# Altium schematic sheet EE194_YESDIG_PCB.SchDoc
size A2
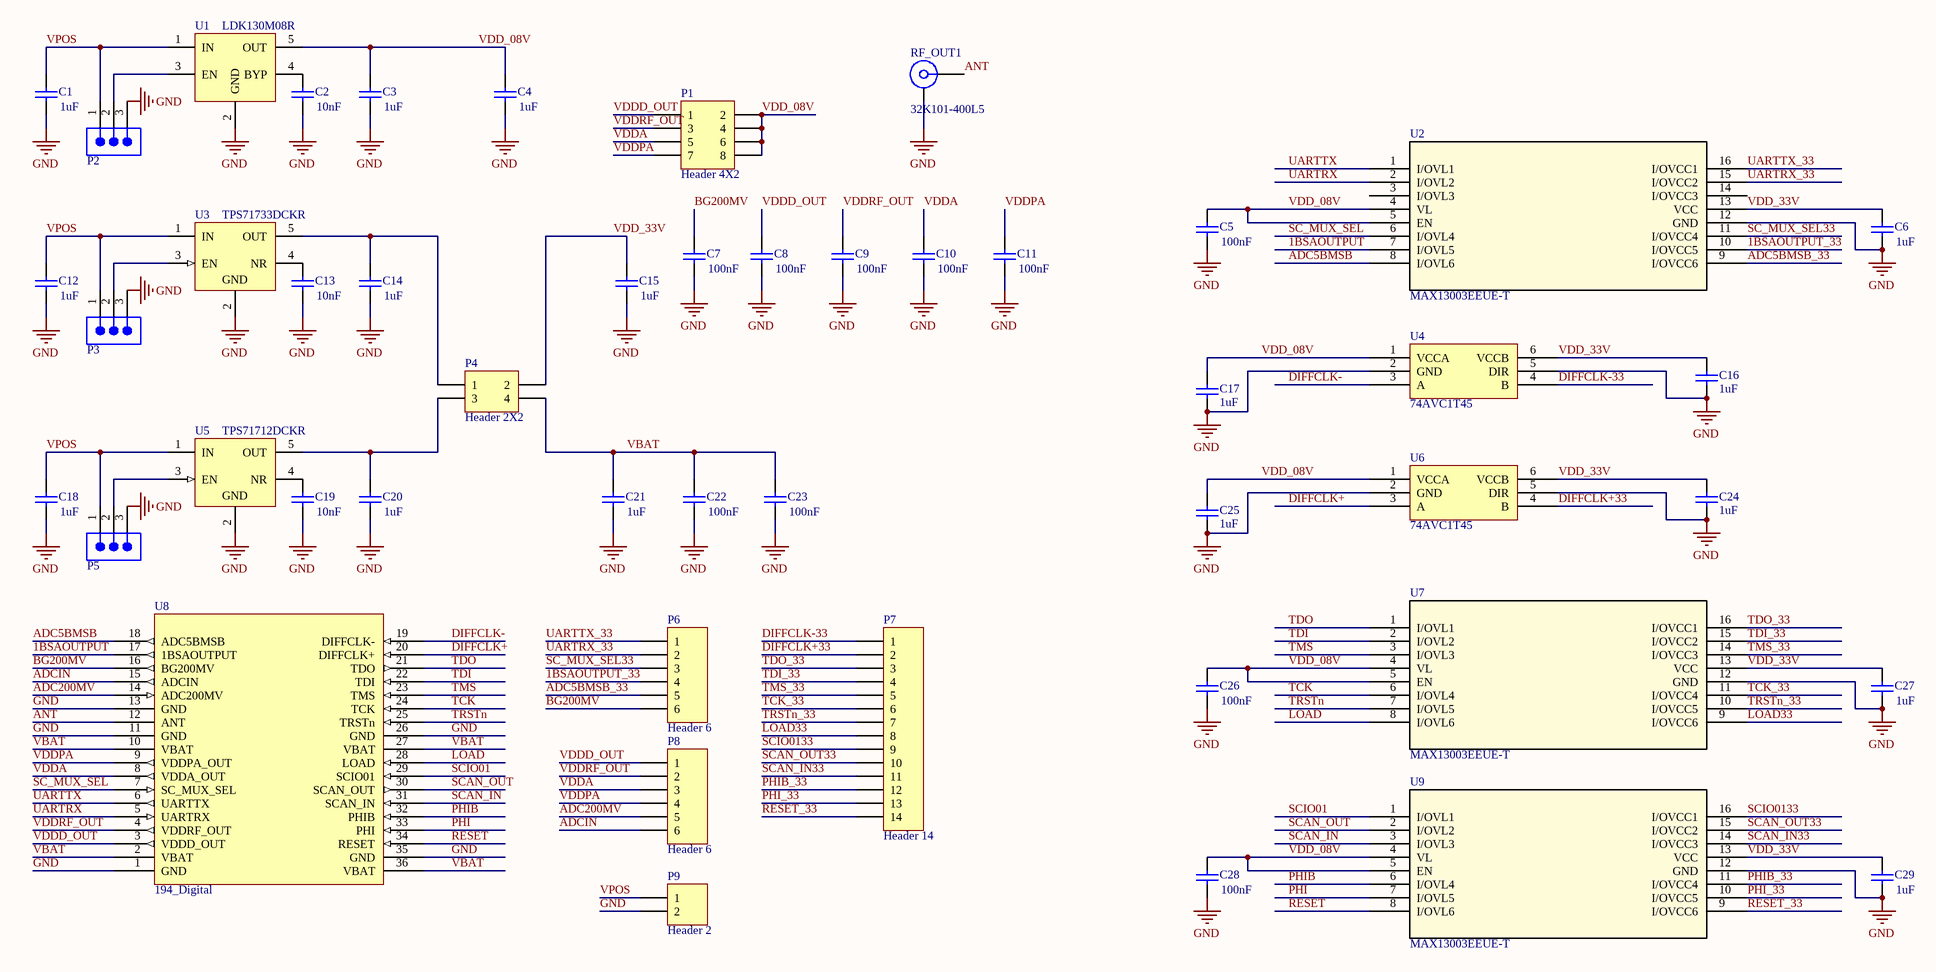
[diagram p0: EE194_YESDIG_PCB.SchDoc]

## Parts
C1  value 1uF  [1608[0603]]  (hidden comment: Cap Semi)
C2  value 10nF  [1608[0603]]  (hidden comment: Cap Semi)
C3  value 1uF  [1608[0603]]  (hidden comment: Cap Semi)
C4  value 1uF  [1608[0603]]  (hidden comment: Cap Semi)
C5  value 100nF  [0402]  (hidden comment: Cap Semi)
C6  value 1uF  [0402]  (hidden comment: Cap Semi)
C7  value 100nF  [0402]  (hidden comment: Cap Semi)
C8  value 100nF  [0402]  (hidden comment: Cap Semi)
C9  value 100nF  [0402]  (hidden comment: Cap Semi)
C10  value 100nF  [0402]  (hidden comment: Cap Semi)
C11  value 100nF  [0402]  (hidden comment: Cap Semi)
C12  value 1uF  [1608[0603]]  (hidden comment: Cap Semi)
C13  value 10nF  [1608[0603]]  (hidden comment: Cap Semi)
C14  value 1uF  [1608[0603]]  (hidden comment: Cap Semi)
C15  value 1uF  [1608[0603]]  (hidden comment: Cap Semi)
C16  value 1uF  [CAPC0402(1005)60_M]  (hidden comment: CAP 1uF 16V 0402(1005))
C17  value 1uF  [CAPC0402(1005)60_M]  (hidden comment: CAP 1uF 16V 0402(1005))
C18  value 1uF  [1608[0603]]  (hidden comment: Cap Semi)
C19  value 10nF  [1608[0603]]  (hidden comment: Cap Semi)
C20  value 1uF  [1608[0603]]  (hidden comment: Cap Semi)
C21  value 1uF  [1608[0603]]  (hidden comment: Cap Semi)
C22  value 100nF  [0402]  (hidden comment: Cap Semi)
C23  value 100nF  [0402]  (hidden comment: Cap Semi)
C24  value 1uF  [CAPC0402(1005)60_M]  (hidden comment: CAP 1uF 16V 0402(1005))
C25  value 1uF  [CAPC0402(1005)60_M]  (hidden comment: CAP 1uF 16V 0402(1005))
C26  value 100nF  [0402]  (hidden comment: Cap Semi)
C27  value 1uF  [0402]  (hidden comment: Cap Semi)
C28  value 100nF  [0402]  (hidden comment: Cap Semi)
C29  value 1uF  [0402]  (hidden comment: Cap Semi)
P1  Header 4X2  [HDR2X4]
P2  TSW-103-07-F-S  [SMTC-TSW-103-07-X-S]  (value not drawn)
P3  TSW-103-07-F-S  [SMTC-TSW-103-07-X-S]  (value not drawn)
P4  Header 2X2  [HDR2X2]
P5  TSW-103-07-F-S  [SMTC-TSW-103-07-X-S]  (value not drawn)
P6  Header 6  [HDR1X6]
P7  Header 14  [HDR1X14]
P8  Header 6  [HDR1X6]
P9  Header 2  [HDR1X2]
RF_OUT1  32K101-400L5  [ROS-32K101-400L5_V]
U1  LDK130M08R  [SOT95P290X145-5N]
U2  MAX13003EEUE-T  [21-0066J_16]
U3  TPS71733DCKR  [DCK0005A_L]
U4  74AVC1T45  [ONSC-SC-88-6-419B-02_L]
U5  TPS71712DCKR  [DCK0005A_L]
U6  74AVC1T45  [ONSC-SC-88-6-419B-02_L]
U7  MAX13003EEUE-T  [21-0066J_16]
U8  194_Digital  [EE194_Analog_Chip - 3 mil]
U9  MAX13003EEUE-T  [21-0066J_16]

## Nets
GND: C1.1 C2.1 C3.1 C4.1 C5.1 C6.1 C7.1 C8.1 C9.1 C10.1 C11.1 C12.1 C13.1 C14.1 C15.1 C16.2 C17.2 C18.1 C19.1 C20.1 C21.1 C22.1 C23.1 C24.2 C25.2 C26.1 C27.1 C28.1 C29.1 P2.3 P3.3 P5.3 P9.2 RF_OUT1.MH U1.2(GND) U2.12(GND) U3.2(GND) U4.2(GND) U4.5(DIR) U5.2(GND) U6.2(GND) U6.5(DIR) U7.12(GND) U8.1(GND) U8.11(GND) U8.13(GND) U8.26(GND) U8.35(GND) U9.12(GND)
1BSAOUTPUT: U2.7(I/OVL5) U8.17(1BSAOUTPUT)
1BSAOUTPUT_33: P6.4 U2.10(I/OVCC5)
ADC5BMSB: U2.8(I/OVL6) U8.18(ADC5BMSB)
ADC5BMSB_33: P6.5 U2.9(I/OVCC6)
ADC200MV: P8.5 U8.14(ADC200MV)
ADCIN: P8.6 U8.15(ADCIN)
ANT: RF_OUT1.1 U8.12(ANT)
BG200MV: C7.2 P6.6 U8.16(BG200MV)
DIFFCLK+: U6.3(A) U8.20(DIFFCLK+)
DIFFCLK+33: P7.2 U6.4(B)
DIFFCLK-: U4.3(A) U8.19(DIFFCLK-)
DIFFCLK-33: P7.1 U4.4(B)
LOAD: U7.8(I/OVL6) U8.28(LOAD)
LOAD33: P7.8 U7.9(I/OVCC6)
PHI: U8.33(PHI) U9.7(I/OVL5)
PHI_33: P7.13 U9.10(I/OVCC5)
PHIB: U8.32(PHIB) U9.6(I/OVL4)
PHIB_33: P7.12 U9.11(I/OVCC4)
RESET: U8.34(RESET) U9.8(I/OVL6)
RESET_33: P7.14 U9.9(I/OVCC6)
SC_MUX_SEL: U2.6(I/OVL4) U8.7(SC_MUX_SEL)
SC_MUX_SEL33: P6.3 U2.11(I/OVCC4)
SCAN_IN: U8.31(SCAN_IN) U9.3(I/OVL3)
SCAN_IN33: P7.11 U9.14(I/OVCC3)
SCAN_OUT: U8.30(SCAN_OUT) U9.2(I/OVL2)
SCAN_OUT33: P7.10 U9.15(I/OVCC2)
SCIO01: U8.29(SCIO01) U9.1(I/OVL1)
SCIO0133: P7.9 U9.16(I/OVCC1)
TCK: U7.6(I/OVL4) U8.24(TCK)
TCK_33: P7.6 U7.11(I/OVCC4)
TDI: U7.2(I/OVL2) U8.22(TDI)
TDI_33: P7.4 U7.15(I/OVCC2)
TDO: U7.1(I/OVL1) U8.21(TDO)
TDO_33: P7.3 U7.16(I/OVCC1)
TMS: U7.3(I/OVL3) U8.23(TMS)
TMS_33: P7.5 U7.14(I/OVCC3)
TRSTn: U7.7(I/OVL5) U8.25(TRSTn)
TRSTn_33: P7.7 U7.10(I/OVCC5)
UARTRX: U2.2(I/OVL2) U8.5(UARTRX)
UARTRX_33: P6.2 U2.15(I/OVCC2)
UARTTX: U2.1(I/OVL1) U8.6(UARTTX)
UARTTX_33: P6.1 U2.16(I/OVCC1)
VBAT: C21.2 C22.2 C23.2 P4.4 U8.2(VBAT) U8.10(VBAT) U8.27(VBAT) U8.36(VBAT)
VDD_08V: C3.2 C4.2 C5.2 C17.1 C25.1 C26.2 C28.2 P1.2 P1.4 P1.6 P1.8 U1.5(OUT) U2.4(VL) U2.5(EN) U4.1(VCCA) U6.1(VCCA) U7.4(VL) U7.5(EN) U9.4(VL) U9.5(EN)
VDD_33V: C6.2 C15.2 C16.1 C24.1 C27.2 C29.2 P4.2 U2.13(VCC) U4.6(VCCB) U6.6(VCCB) U7.13(VCC) U9.13(VCC)
VDDA: C10.2 P1.5 P8.3 U8.8(VDDA_OUT)
VDDD_OUT: C8.2 P1.1 P8.1 U8.3(VDDD_OUT)
VDDPA: C11.2 P1.7 P8.4 U8.9(VDDPA_OUT)
VDDRF_OUT: C9.2 P1.3 P8.2 U8.4(VDDRF_OUT)
VPOS: C1.2 C12.2 C18.2 P2.1 P3.1 P5.1 P9.1 U1.1(IN) U3.1(IN) U5.1(IN)
NetC2_2: C2.2 U1.4(BYP)
NetC13_2: C13.2 U3.4(NR)
NetC14_2: C14.2 P4.1 U3.5(OUT)
NetC19_2: C19.2 U5.4(NR)
NetC20_2: C20.2 P4.3 U5.5(OUT)
NetP2_2: P2.2 U1.3(EN)
NetP3_2: P3.2 U3.3(EN)
NetP5_2: P5.2 U5.3(EN)

Not connected (* = marked no-connect by the designer): U2 3(I/OVL3) 14(I/OVCC3)

## Library data of the parts
C1-C15 C18-C23 C26-C29 = Cap Semi: Capacitor (Semiconductor SIM Model); Published: 8-Jun-2000; LatestRevisionDate: 29-May-2009; LatestRevisionNote: IPC-7351 Footprint Added.; PackageReference: C1206; Publisher: Altium Limited; PackageDescription: Chip Capacitor
C16 C17 C24 C25 = CMP-1034-02119-1: CAP 1uF 16V ±10% 0402 (1005 Metric) Thickness 0.6mm SMD; Case-EIA: 0402; Tolerance: Â±10%; Case-Metric: 1005; Technology: SMT; Rated Voltage: 16 V; Max Thickness: 0.6 mm
P1 = Header 4X2: Header, 4-Pin, Dual row; LatestRevisionDate: 17-Jul-2002; LatestRevisionNote: Re-released for DXP Platform.; Publisher: Altium Limited
P2 P3 P5 = CMP-1024-00331-1: 0.025" SQ Post Header, Through-hole, Vertical, -55 to 125 degC, 2.54 mm Pitch, 3-Pin, Male, RoHS; Manufacturer: Samtec; Pitch: 2.54 mm; DatasheetVersion: F-214; ComponentLink1Description: Manufacturer URL; ComponentLink3URL: http://www.samtec.com/documents/webfiles/cpdf/TSW-XXX-XX-XXX-X-XX-XXX-MKT.pdf; Mounting Technology: Through-hole; PackageDescription: .025[0.64] SQ. Post Terminal Strip Assembly; Temperature Range: -55 to 125 degC; ComponentLink3Description: Package Specification; Orientation: Vertical; PartNumber: TSW-103-07-F-S; RoHS: True; PackageVersion: DM, 8/1988; ComponentLink2Description: Datasheet; ComponentLink1URL: http://www.samtec.com; ComponentLink2URL: http://www.samtec.com/documents/webfiles/pdf/TSW_TH.PDF; PackageReference: TSW-103-07-X-S
P4 = Header 2X2: Header, 2-Pin, Dual row; LatestRevisionDate: 17-Jul-2002; LatestRevisionNote: Re-released for DXP Platform.; Publisher: Altium Limited
P6 P8 = Header 6: Header, 6-Pin; LatestRevisionDate: 17-Jul-2002; LatestRevisionNote: Re-released for DXP Platform.; Publisher: Altium Limited
P7 = Header 14: Header, 14-Pin; LatestRevisionDate: 17-Jul-2002; LatestRevisionNote: Re-released for DXP Platform.; Publisher: Altium Limited
P9 = Header 2: Header, 2-Pin; LatestRevisionDate: 17-Jul-2002; LatestRevisionNote: Re-released for DXP Platform.; Publisher: Altium Limited
RF_OUT1 = CMP-0751-00001-1: SMA Straight Jack, Up to 18 GHz, -55 to 155 degC; Manufacturer: Rosenberger; Design Note: Footprint in library is a generic example - only application specific footprint delivers High Performance; PartNumber: 32K101-400L5; PackageDescription: SMA Straight Jack, 6.35 x 6.35 x 9.5 mm; ComponentLink5URL: http://www.rosenberger.com/en/contact/sales/; DatasheetVersion: a00; ComponentLink3URL: http://rosenberger.de/ok/images/documents/db/32K101-400L5.pdf; ComponentLink4Description: Series Overview / Design Note; ComponentLink5Description: Webshop / RFQ; PackageReference: 32K101-400L5; ComponentLink2Description: Datasheet; PackageVersion: a00; ComponentLink1Description: Manufacturer URL; ComponentLink3Description: Package Specification; ComponentLink2URL: http://rosenberger.de/ok/images/documents/db/32K101-400L5.pdf; Mounting Technology: Through Hole; ComponentLink1URL: http://www.rosenberger.de; ComponentLink4URL: http://rosenberger.de/ok/images/documents/spez/32.pdf
U1 = LDK130M08R: 300 mA low quiescent current very low noise LDO (800mV)
U2 U7 U9 = MAX13003EEUE-T: Imported; Vendor: Maxim; Manufacturer_Part_Number: MAX13003EEUE-T; Manufacturer_Name: Maxim; RefDes: RefDes; Type: Type; Value: Value
U3 = TI-TPS79NXX-YYSOT5: Single Output High PSRR LDO, 150 mA, Fixed 1.2 V Output, 2.5 to 6.5 V Input, 5-pin SC70 (DCK), -40 to 125 degC, Green (RoHS & no Sb/Br); PartNumber: TPS71712DCKR; Manufacturer: Texas Instruments; Accuracy(%): 3; Fixed Output Options(V): 1.2; Vin(Min)(V): 2.5; SubFamily: Single Channel LDO; Vin(Max)(V): 6.5; Iout(Max)(A): 0.15; Iq(Typ)(mA): 0.05; Vdo(Typ)(mV): 170; DatasheetVersion: SBVS068G; PackageReference: DCK0005A; ComponentLink3Description: Package Specification; Eco-Plan: Green (RoHS & no Sb/Br); ComponentLink2Description: Datasheet; PackageDescription: 5-Pin Plastic Small-Outline, Body 2 x 1.25 mm, Pitch 0.65 mm; ComponentLink1URL: http://www.ti.com/; ComponentLink1Description: Manufacturer URL; PackageVersion: 4093553-3/G; Vout Adj(Min)(V): 1.2; ComponentLink2URL: http://www.ti.com/general/docs/lit/getliterature.tsp?genericPartNumber=TPS71712&fileType=pdf; Vout Adj(Max)(V): 1.2; ComponentLink3URL: http://www.ti.com/litv/pdf/mpds025f; Mounting Technology: Surface Mount; Code_JEDEC: MO-203
U5 = TI-TPS79NXX-YYSOT5: Single Output High PSRR LDO, 150 mA, Fixed 1.2 V Output, 2.5 to 6.5 V Input, 5-pin SC70 (DCK), -40 to 125 degC, Green (RoHS & no Sb/Br); Manufacturer: Texas Instruments; Accuracy(%): 3; Fixed Output Options(V): 1.2; Vin(Min)(V): 2.5; SubFamily: Single Channel LDO; Vin(Max)(V): 6.5; Iout(Max)(A): 0.15; Iq(Typ)(mA): 0.05; Vdo(Typ)(mV): 170; DatasheetVersion: SBVS068G; PackageReference: DCK0005A; PartNumber: TPS71712DCKR; ComponentLink3Description: Package Specification; Eco-Plan: Green (RoHS & no Sb/Br); ComponentLink2Description: Datasheet; PackageDescription: 5-Pin Plastic Small-Outline, Body 2 x 1.25 mm, Pitch 0.65 mm; ComponentLink1URL: http://www.ti.com/; ComponentLink1Description: Manufacturer URL; PackageVersion: 4093553-3/G; Vout Adj(Min)(V): 1.2; ComponentLink2URL: http://www.ti.com/general/docs/lit/getliterature.tsp?genericPartNumber=TPS71712&fileType=pdf; Vout Adj(Max)(V): 1.2; ComponentLink3URL: http://www.ti.com/litv/pdf/mpds025f; Mounting Technology: Surface Mount; Code_JEDEC: MO-203